# Altium schematic sheet FPGA_GND.SchDoc
size A
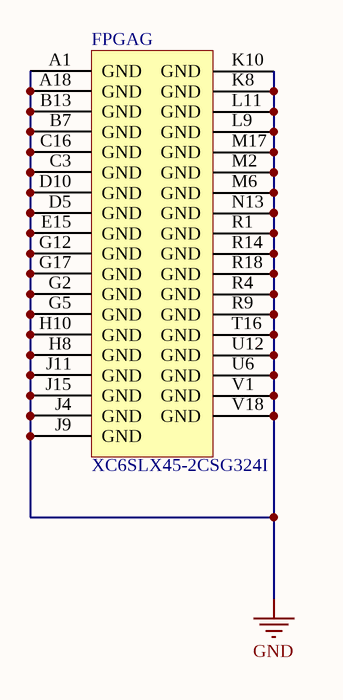
[diagram p0: FPGA_GND.SchDoc]

## Parts
FPGA  XC6SLX45-2CSG324I  [CSG324]  (part G of 8)

## Nets
GND: FPGA.A1(GND) FPGA.A18(GND) FPGA.B7(GND) FPGA.B13(GND) FPGA.C3(GND) FPGA.C16(GND) FPGA.D5(GND) FPGA.D10(GND) FPGA.E15(GND) FPGA.G2(GND) FPGA.G5(GND) FPGA.G12(GND) FPGA.G17(GND) FPGA.H8(GND) FPGA.H10(GND) FPGA.J4(GND) FPGA.J9(GND) FPGA.J11(GND) FPGA.J15(GND) FPGA.K8(GND) FPGA.K10(GND) FPGA.L9(GND) FPGA.L11(GND) FPGA.M2(GND) FPGA.M6(GND) FPGA.M17(GND) FPGA.N13(GND) FPGA.R1(GND) FPGA.R4(GND) FPGA.R9(GND) FPGA.R14(GND) FPGA.R18(GND) FPGA.T16(GND) FPGA.U6(GND) FPGA.U12(GND) FPGA.V1(GND) FPGA.V18(GND)

## Library data of the parts
FPGA = CMP-0067-00402-1: Spartan-6 LX 1.2V FPGA, 218 User I/Os, 324-Ball Chip-Scale BGA (0.8mm Pitch), Speed Grade 2, Industrial Grade, Pb-Free; Code_JEDEC: MO-275-KKAC-1; PackageDescription: 324-Ball Chip-Scale BGA (CSG324) Package, 0.8 mm Pitch; DatasheetVersion: ver1.6, Nov-2010; PackageVersion: ver1.1, Nov-2009; PackageReference: CSG324